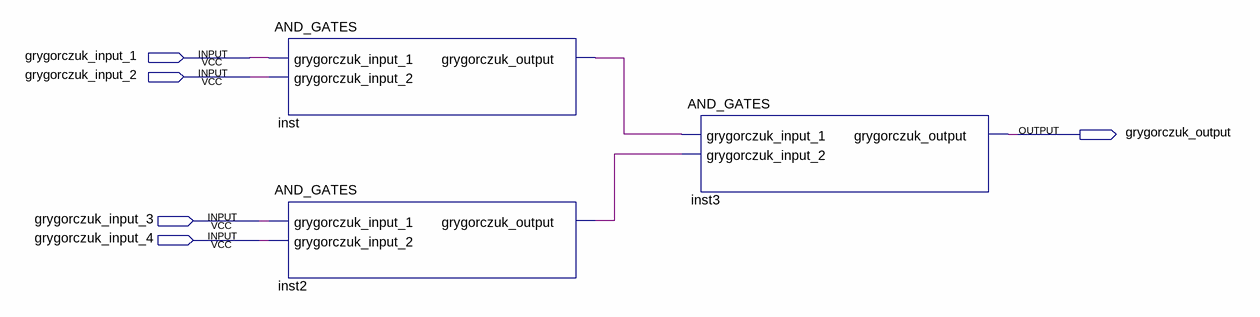
[diagram p0: schematic sheet]
// Quartus schematic FOUR_PIN_AND_GATES.bdf as structural Verilog: 3 symbols, 5 pins
module FOUR_PIN_AND_GATES (
  input  grygorczuk_input_1,
  input  grygorczuk_input_2,
  input  grygorczuk_input_3,
  input  grygorczuk_input_4,
  output grygorczuk_output
);

  wire inst2_grygorczuk_output, inst_grygorczuk_output;

  AND_GATES inst (
    .grygorczuk_input_1(grygorczuk_input_1), .grygorczuk_input_2(grygorczuk_input_2),
    .grygorczuk_output(inst_grygorczuk_output));
  AND_GATES inst2 (
    .grygorczuk_input_1(grygorczuk_input_3), .grygorczuk_input_2(grygorczuk_input_4),
    .grygorczuk_output(inst2_grygorczuk_output));
  AND_GATES inst3 (
    .grygorczuk_input_1(inst_grygorczuk_output), .grygorczuk_input_2(inst2_grygorczuk_output),
    .grygorczuk_output(grygorczuk_output));
endmodule
